# Altium project ESP32 Transmitter.PrjPcb
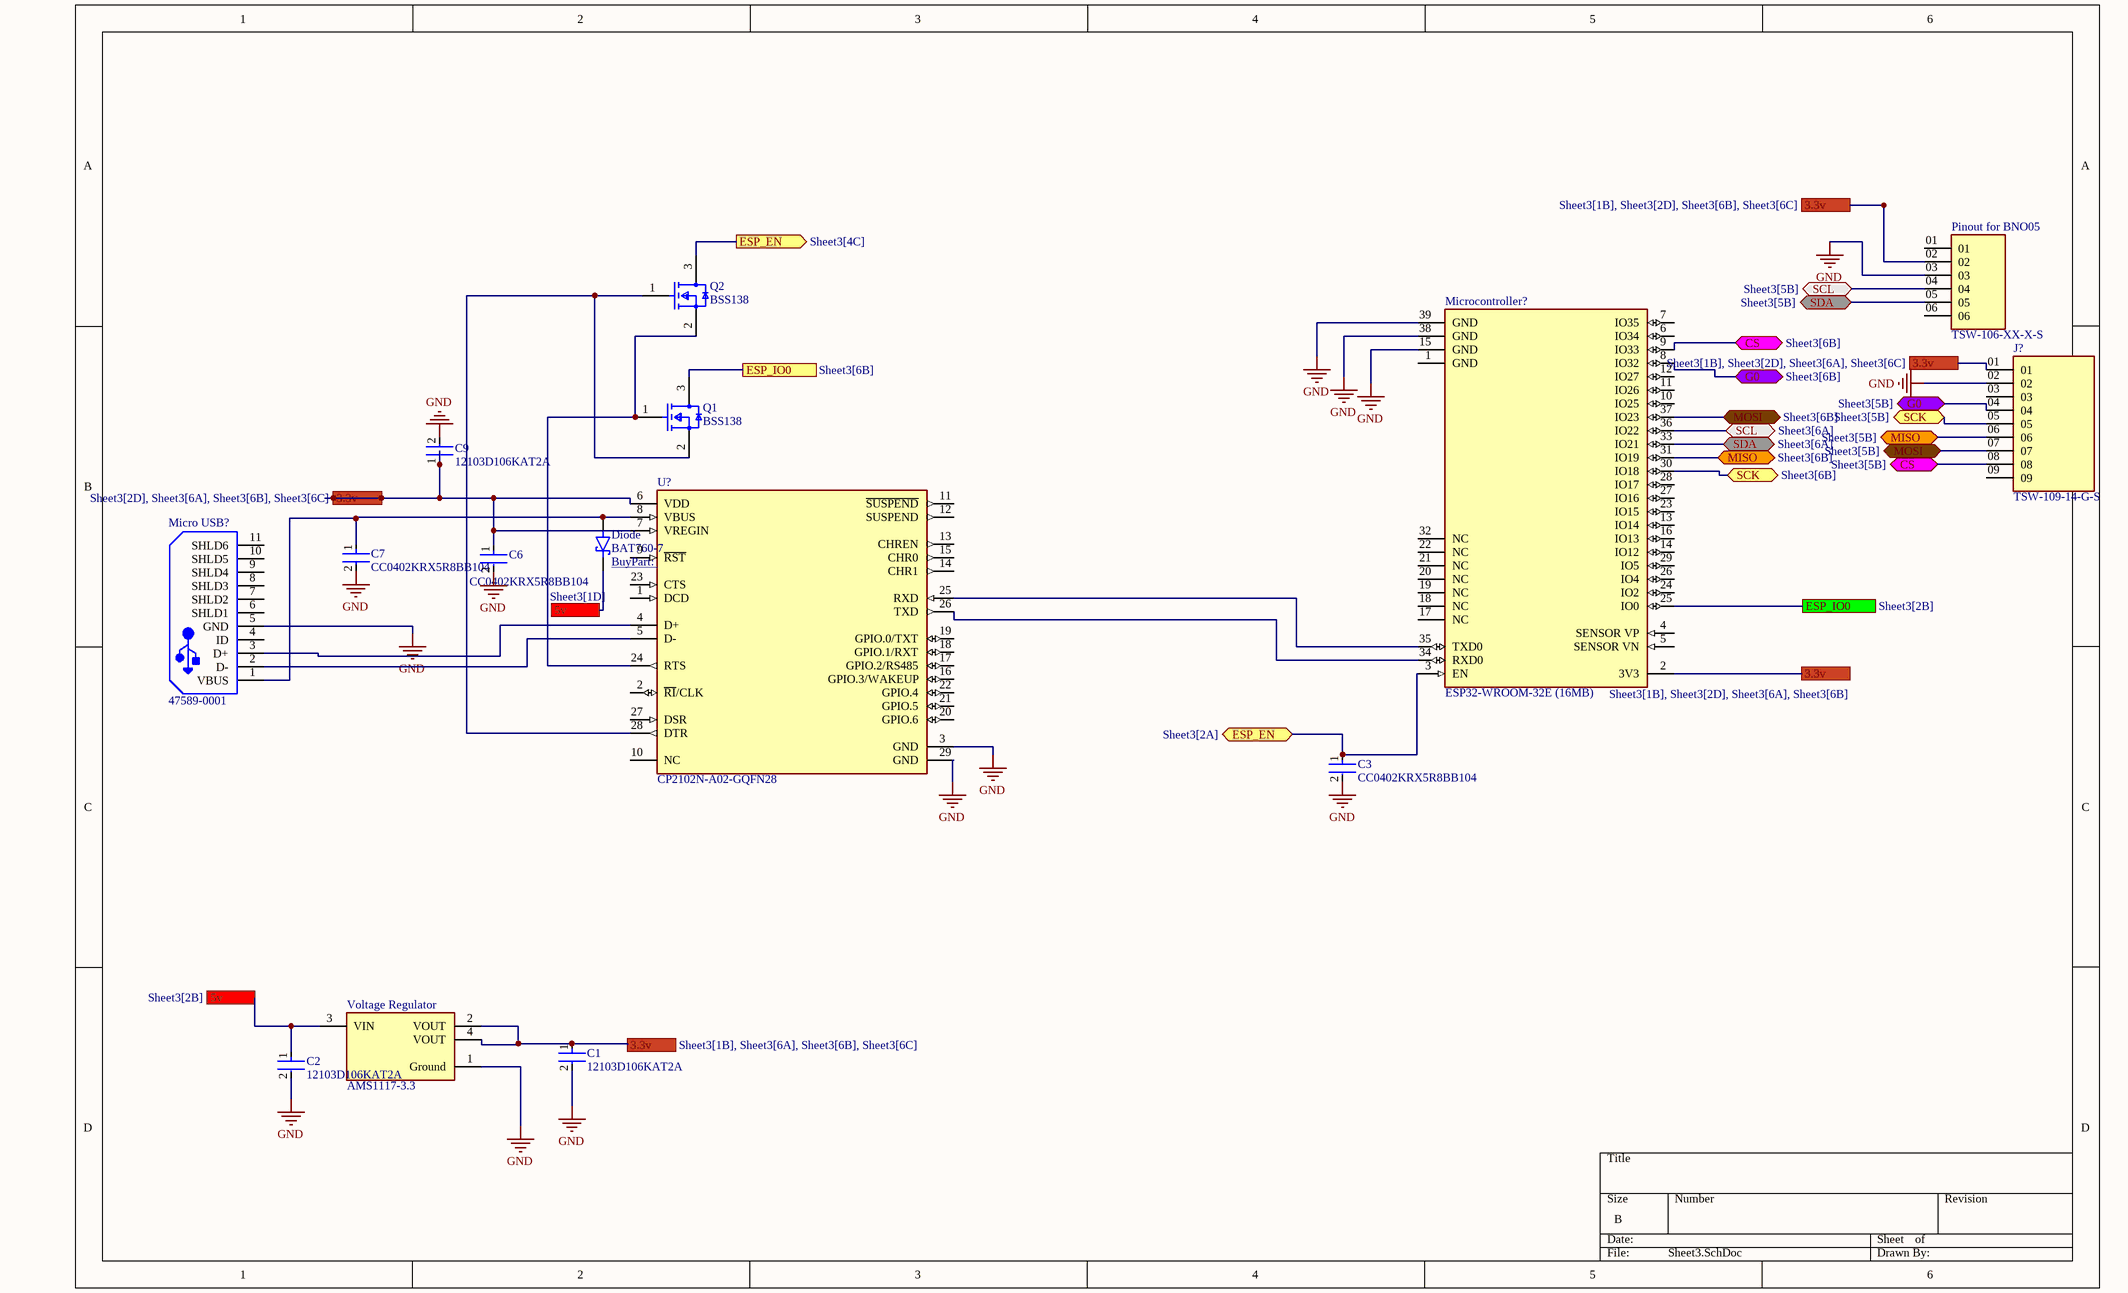
[diagram p0: Sheet3.SchDoc]
1 sheet, 15 parts. Net scope: flat (ports and power ports of the same name join across sheets).
Board file: PCB1.PcbDoc

## Sheet Sheet3.SchDoc
size B; SheetNumber: 1; SheetTotal: 1

### Parts
C1  12103D106KAT2A  [FP-1210-L_3_3_0_4-W_2_5_0-MFG]
C2  12103D106KAT2A  [FP-1210-L_3_3_0_4-W_2_5_0-MFG]
C3  CC0402KRX5R8BB104  [FP-CC0402-MFG]
C6  CC0402KRX5R8BB104  [FP-CC0402-MFG]
C7  CC0402KRX5R8BB104  [FP-CC0402-MFG]
C9  12103D106KAT2A  [FP-1210-L_3_3_0_4-W_2_5_0-MFG]
Diode  BAT760-7  [SOD2513X120N]
J?  TSW-109-14-G-S  [SAMTEC_TSW-109-14-G-S]
Micro_USB?  47589-0001  [MOLX-47589-0001_V]
Microcontroller?  ESP32-WROOM-32E (16MB)  [FP-ESP32-WROOM-32E_16MB-MFG]
Pinout_for_BNO05  TSW-106-XX-X-S  [SAMTEC_TSW-106-XX-X-S]
Q1  BSS138  [FP-318-08-IPC_B]
Q2  BSS138  [FP-318-08-IPC_B]
U?  CP2102N-A02-GQFN28  [FP-CP2102N-A02-GQFN28-MFG]
Voltage_Regulator  AMS1117-3.3  [FP-AMS1117-IPC_C]

### Ports
3.3v (see Sheet3[1B], Sheet3[2D], Sheet3[6A], Sheet3[6B]), 3.3v (see Sheet3[1B], Sheet3[2D], Sheet3[6A], Sheet3[6C]), 3.3v (see Sheet3[1B], Sheet3[2D], Sheet3[6B], Sheet3[6C]), 3.3v (see Sheet3[1B], Sheet3[6A], Sheet3[6B], Sheet3[6C]), 3.3v (see Sheet3[2D], Sheet3[6A], Sheet3[6B], Sheet3[6C]), 5v (see Sheet3[1D]), 5v (see Sheet3[2B]), CS (bidir, see Sheet3[5B]), CS (bidir, see Sheet3[6B]), ESP_EN (bidir, see Sheet3[2A]), ESP_EN (out, see Sheet3[4C]), ESP_IO0 (see Sheet3[2B]), ESP_IO0 (see Sheet3[6B]), G0 (bidir, see Sheet3[5B]), G0 (bidir, see Sheet3[6B]), MISO (bidir, see Sheet3[5B]), MISO (bidir, see Sheet3[6B]), MOSI (bidir, see Sheet3[5B]), MOSI (bidir, see Sheet3[6B]), SCK (bidir, see Sheet3[5B]), SCK (bidir, see Sheet3[6B]), SCL (bidir, see Sheet3[5B]), SCL (bidir, see Sheet3[6A]), SDA (bidir, see Sheet3[5B]), SDA (bidir, see Sheet3[6A])

### Nets
GND: C1.2 C2.2 C3.2 C6.2 C7.2 C9.2 J?.02 Micro_USB?.5(GND) Microcontroller?.15(GND) Microcontroller?.38(GND) Microcontroller?.39(GND) Pinout_for_BNO05.03 U?.3(GND) U?.29(GND) Voltage_Regulator.1(Ground)
NetC1_1: C1.1 C6.1 C9.1 J?.01 Microcontroller?.2(3V3) Pinout_for_BNO05.02 U?.6(VDD) U?.7(VREGIN) Voltage_Regulator.2(VOUT) Voltage_Regulator.4(VOUT) ; port 3.3v
NetC2_1: C2.1 Diode.C(K) Voltage_Regulator.3(VIN) ; port 5v
NetC3_1: C3.1 Microcontroller?.3(EN) Q2.3(D) ; port ESP_EN
NetC7_1: C7.1 Diode.A Micro_USB?.1(VBUS) U?.8(VBUS)
NetJ?_04: J?.04 Microcontroller?.8(IO32) ; port G0
NetJ?_05: J?.05 Microcontroller?.30(IO18) ; port SCK
NetJ?_06: J?.06 Microcontroller?.31(IO19) ; port MISO
NetJ?_07: J?.07 Microcontroller?.37(IO23) ; port MOSI
NetJ?_08: J?.08 Microcontroller?.9(IO33) ; port CS
NetMicro_USB?_2: Micro_USB?.2(D-) U?.5(D-)
NetMicro_USB?_3: Micro_USB?.3(D+) U?.4(D+)
NetMicrocontroller?_25: Microcontroller?.25(IO0) Q1.3(D) ; port ESP_IO0
NetMicrocontroller?_33: Microcontroller?.33(IO21) Pinout_for_BNO05.05 ; port SDA
NetMicrocontroller?_34: Microcontroller?.34(RXD0) U?.26(TXD)
NetMicrocontroller?_35: Microcontroller?.35(TXD0) U?.25(RXD)
NetMicrocontroller?_36: Microcontroller?.36(IO22) Pinout_for_BNO05.04 ; port SCL
NetQ1_1: Q1.1(G) Q2.2(S) U?.24(RTS)
NetQ1_2: Q1.2(S) Q2.1(G) U?.28(DTR)

Not connected (* = marked no-connect by the designer): J? 03 09; Micro_USB? 4(ID) 6(SHLD1) 7(SHLD2) 8(SHLD3) 9(SHLD4) 10(SHLD5) 11(SHLD6); Microcontroller? 1(GND) 4(SENSOR_VP) 5(SENSOR_VN) 6(IO34) 7(IO35) 10(IO25) 11(IO26) 12(IO27) 13(IO14) 14(IO12) 16(IO13) 17(NC) 18(NC) 19(NC) 20(NC) 21(NC) 22(NC) 23(IO15) 24(IO2) 26(IO4) 27(IO16) 28(IO17) 29(IO5) 32(NC); Pinout_for_BNO05 01 06; U? 1(DCD) 2(~{RI}/CLK) 9(~{RST}) 10(NC) 11(~{SUSPEND}) 12(SUSPEND) 13(CHREN) 14(CHR1) 15(CHR0) 16(GPIO.3/WAKEUP) 17(GPIO.2/RS485) 18(GPIO.1/RXT) 19(GPIO.0/TXT) 20(GPIO.6) 21(GPIO.5) 22(GPIO.4) 23(CTS) 27(DSR)

### Library data of the parts
C1 C2 C9 = CMP-2000-05477-2: General Purpose Ceramic Capacitor, 1210, 10uF, 10%, X5R, 15%, 25V; Lead Free: Lead Free; Max Operating Temperature: 85°C; REACH SVHC: No SVHC; Depth: 2.5mm; Packaging: Tape and Reel; Min Operating Temperature: -55°C; Height: 2.29mm; Construction: Flat; Case Code (Imperial): 1210; Radiation Hardening: No; Voltage: 25V; Case/Package: 1210; Series: -; Dielectric: X5R; Length: 3.2mm; Thickness: 0.11inch; Package Quantity: 1; Termination: SMD/SMT; Case Code (Metric): 3225; Voltage Rating (DC): 25V; Voltage Rating: 25V; Contact Plating: Tin; RoHS Compliant: Yes; Mount: Surface Mount; Width: 0.098inch; Capacitance: 10uF; Tolerance: 10%
C3 C6 C7 = CMP-03422-000607-1: CAP CER 0.1UF 25V X5R 0402; Manufacturer: YAGEO; Tolerance: 0.1; Value: 100 nF; Material: Ceramic; Automotive Grade: NA; Temperature Coefficient: 30ppm/°C; Height: 0.55mm; Voltage Rating: 25 V; Octopart: https://octopart.com/cc0402krx5r8bb104-yageo-20779263; Mouser Description: Multilayer Ceramic Capacitors MLCC - SMD/SMT 100nF 25V X5R 10%; Category: Cap; Lead Free: Yes; Device Class L2: Capacitors; Device Class L1: Passive Components; Digikey Description: CAP CER 0.1UF 25V X5R 0402; Device Class L3: Ceramic Capacitors; Temperature: -55°C to +125°C; Ipc Land Pattern Name: CAPC10050X50; Automotive: No; Package: CC0402; Temperature Range High: +125°C; RoHS: TRUE; ComponentLink2Description: Datasheet; Footprint Url: http://www.yageo.com/exep/pages/download/literatures/UPY-C_GEN_24.pdf; Capacitance: 100 nF; ComponentLink2URL: http://www.yageo.com/documents/recent/UPY-GP_NP0_16V-to-50V_16.pdf; Temperature Range Low: -55°C; Temperature Characteristic: X5R; Manufacturer Part Number: CC0402KRX5R8BB104
Diode = BAT760-7: Diode Schottky 30V 1A 2-Pin SOD-323 T/R; MF: Diodes Zetex; MP: BAT760-7; SnapEDA_Link: https://www.snapeda.com/parts/BAT760-7/Zetex/view-part/4817231/?ref=snap; Value: *; DigiKey-Purchase-URL: https://snapeda.com/shop?store=DigiKey&id=4817231; Package: None; Mouser-Purchase-URL: https://snapeda.com/shop?store=Mouser&id=4817231; Price: None; Availability: Good
J? = TSW-109-14-G-S: Connector Header Through Hole 9 position 0.100 (2.54mm); MF: Samtec; SnapEDA_Link: https://www.snapeda.com/parts/TSW-109-14-G-S/Samtec/view-part/?ref=snap; Package: None; Value: *; MP: TSW-109-14-G-S; Check_prices: https://www.snapeda.com/parts/TSW-109-14-G-S/Samtec/view-part/?ref=eda
Micro_USB? = CMP-2000-05610-1: Right Angle Female Type AB Micro USB Connector, 30 V, 1.8 A, -30 to 85 degC, RoHS, Tape and Reel; Number of Ports: 1Port; Current Rating: 1.8A; Brand: Molex; Connector Type: MicroUSBTypeABreceptacle; Number of Contacts: 5Contact; Voltage Rating: 30VAC; Color: Black; Product: MicroUSBTypeABConnectors; Package URL: http://www.molex.com/pdm_docs/sd/475890001_sd.pdf; Contact Plating: Gold; Datasheet URL: http://www.molex.com/webdocs/datasheets/pdf/en-us/0475890001_IO_CONNECTORS.pdf; Operating Temperature Range: -20Cto+85C; Termination Style: SMD/SMT; Mounting Angle: Right; Package Reference: 47589-0001; Gender: Female; Package Description: Micro USB Connector, Pitch 0.65 mm, 5 Positions, Body 7.5 x 5.6 mm; Mounting Technology: SurfaceMount; Contact Material: CopperAlloy; Packaging: Reel; RoHS: True; Standard: USB; Manufacturer URL: http://www.molex.com/; Manufacturer: Molex; Datasheet Version: 12/2016; Product Category: USBConnectors; Series: 47589
Microcontroller? = CMP-194065-000027-1: RX TXRX MOD WIFI TRACE ANT SMD
Pinout_for_BNO05 = TSW-106-XX-X-S: Connector Header Through Hole 6 position 0.100 (2.54mm); MF: Samtec; MP: TSW-106-26-T-S; SnapEDA_Link: https://www.snapeda.com/parts/TSW-106-26-T-S/Samtec/view-part/?ref=snap; Package: None; Value: *; Check_prices: https://www.snapeda.com/parts/TSW-106-26-T-S/Samtec/view-part/?ref=eda
Q1 Q2 = CMP-07173-000101-1: MOSFET N-CH 50V 220MA SOT-23; Turn-Off Delay Time: 20ns; Element Configuration: Single; Rds On Max: 3.5R; Gate to Source Voltage (Vgs): 20V; Threshold Voltage: 1.3V; Number of Elements: 1; Power Dissipation: 360mW; Rise Time: 9ns; Turn-On Delay Time: 2.5ns; Input Capacitance: 27pF; On-State Resistance: 6R; Lead Free: Lead Free; Length: 2.92mm; Width: 1.3mm; Drain to Source Breakdown Voltage: 50V; Min Operating Temperature: -55°C; REACH SVHC: No SVHC; Packaging: Tape and Reel; Radiation Hardening: No; Height: 0.93mm; Drain to Source Voltage (Vdss): 50V; Current Rating: 220mA; Voltage Rating (DC): 50V; Weight: 0.03g; Continuous Drain Current (ID): 220mA; Number of Pins: 3; Nominal Vgs: 1.3V; Max Power Dissipation: 360mW; Fall Time: 9ns; Drain to Source Resistance: 3.5R; Contact Plating: Tin; Case/Package: SOT-23; Package Quantity: 1; Dual Supply Voltage: 50V; Mount: Surface Mount; Termination: SMD/SMT; Max Operating Temperature: 150°C
U? = CMP-08093-000005-1: IC USB TO UART BRIDGE QFN28
Voltage_Regulator = CMP-209535-000001-1: LDO Voltage Regulators 1A, 3.3V; Manufacturer: Advanced Monolithic Systems; Dropout Voltage: 1.1V; Output Type: Fixed; Nominal Supply Current: 5mA; Max Power Dissipation: 1.2W; Max Supply Voltage: 15V; Number Of Outputs: 1; Standoff Height: 0.64mm; Max Junction Temp: +125°C; Height: 1.8mm; Package: AMS1117; Device Class L2: Power Management ICs; ComponentLink2Description: Datasheet; ComponentLink2URL: http://www.advanced-monolithic.com/pdf/ds1117.pdf; Category: IC; RoHS: TRUE; Automotive: No; Device Class L1: Integrated Circuits (ICs); Output Current: 1A; Device Class L3: Voltage Regulators - Linear; Temperature: -40°C to +125°C; Output Voltage: 3.3V; Manufacturer Part Number: AMS1117-3.3; Temperature Range Low: -40°C; Octopart: https://octopart.com/ams1117-3.3-advanced+monolithic+systems-25899300; Lead Free: Yes; Ipc Land Pattern Name: SOT229P700X180-4; Temperature Range High: +125°C